# Altium project PMR_for_R124_v2.PrjPcb (part 2 of 5)

## Sheet MCU.SchDoc
size A4; DocumentNumber: 2; SheetNumber: 3; SheetTotal: 11
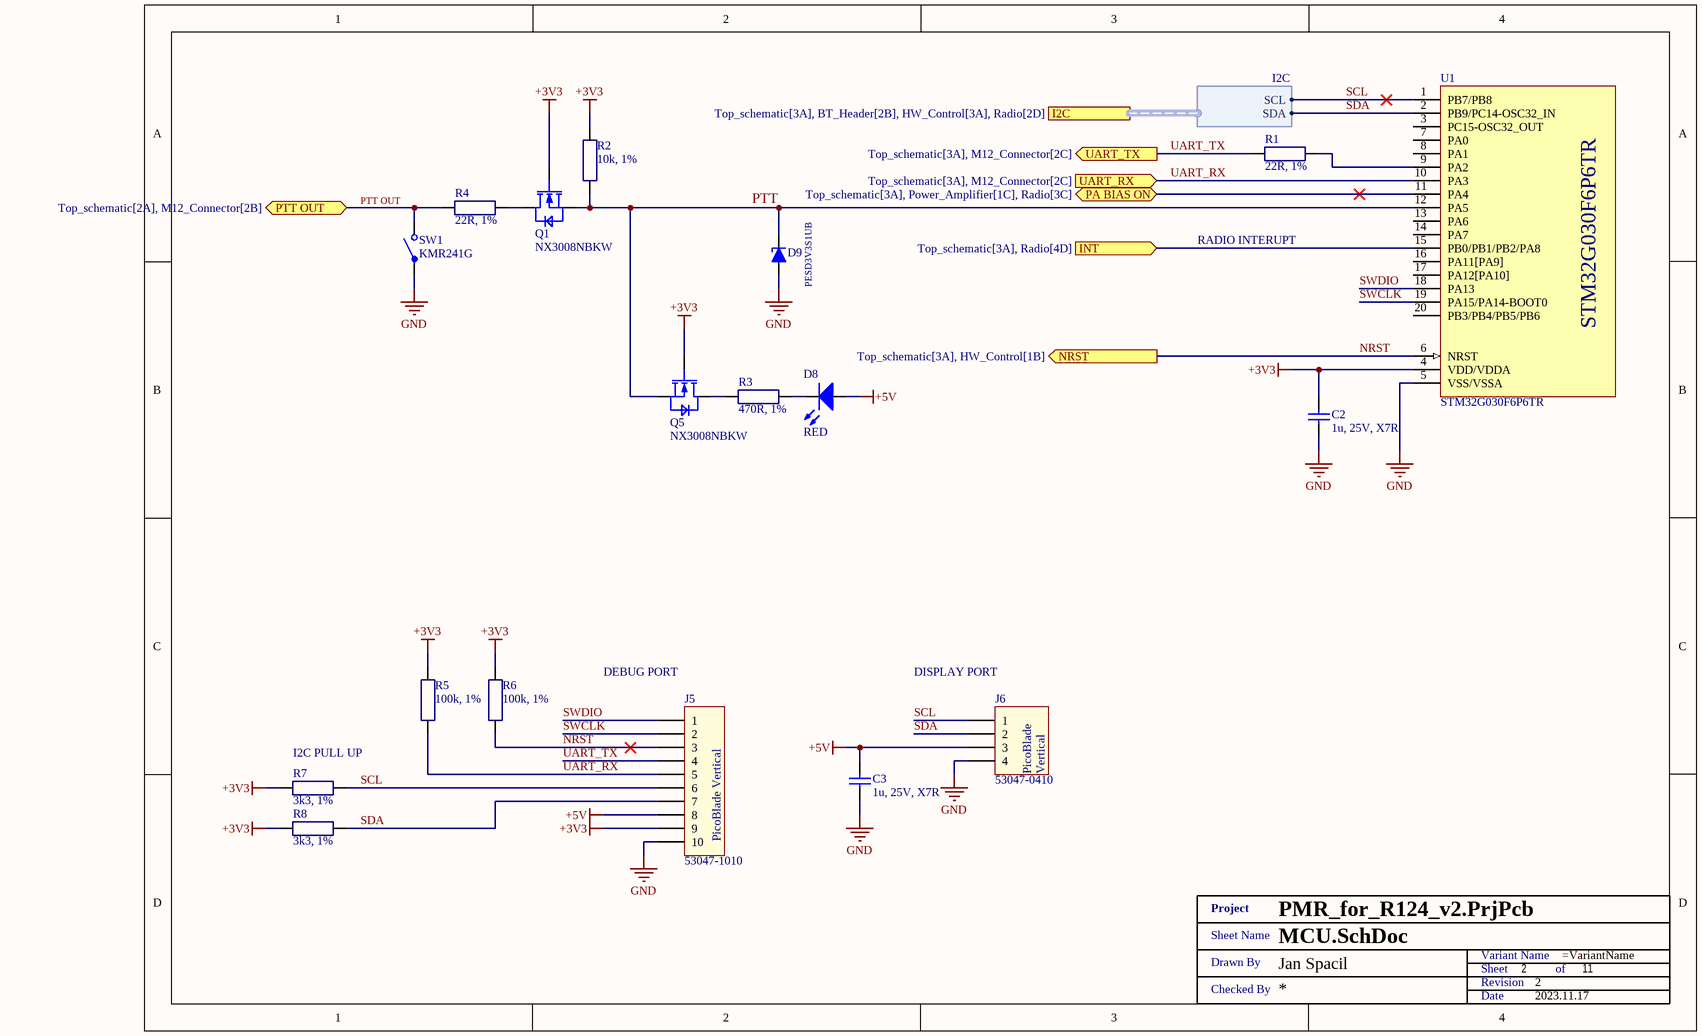
[diagram p3: MCU.SchDoc]

### Parts
(Parts that share a designator on the sheet are numbered #1, #2 ... from top to bottom, then left to right.)
C2  1u, 25V, X7R  [SMD0603]
C3  1u, 25V, X7R  [SMD0603]
D8  RED  [MCL-S270]
D9  PESD3V3S1UB  [SOD523]
J5  53047-1010  [530471010]
J6  53047-0410  [530470410]
Q1  NX3008NBKW  [SOT323]
Q5  NX3008NBKW  [SOT323]
R1  22R, 1%  [SMD0603 - R]
R2  10k, 1%  [SMD0603 - R]
R3  470R, 1%  [SMD0603 - R]
R4  22R, 1%  [SMD0603 - R]
R5  100k, 1%  [SMD0603 - R]
R6  100k, 1%  [SMD0603 - R]
R7  3k3, 1%  [SMD0603 - R]
R8  3k3, 1%  [SMD0603 - R]
SW1  KMR241G  [KMR2]
U1  STM32G030F6P6TR  [TSSOP20]
XX?#4  Title 1  (value not drawn)  (graphical)

### Ports
I2C (harness I2C, see Top_schematic[3A], BT_Header[2B], HW_Control[3A], Radio[2D]), INT (in, see Top_schematic[3A], Radio[4D]), NRST (out, see Top_schematic[3A], HW_Control[1B]), PA BIAS ON (bidir, see Top_schematic[3A], Power_Amplifier[1C], Radio[3C]), PTT OUT (bidir, see Top_schematic[2A], M12_Connector[2B]), UART_RX (in, see Top_schematic[3A], M12_Connector[2C]), UART_TX (out, see Top_schematic[3A], M12_Connector[2C])

### Harnesses
I2C: SCL, SDA

### Nets
+3V3: C2.1 J5.9 Q1.1(G) Q5.1(G) R2.1 R5.2 R6.2 R7.1 R8.1 U1.4(VDD/VDDA)
+5V: C3.1 D8.2(A) J5.8 J6.3
GND: C2.2 C3.2 D9.2(K) J5.10 J6.4 SW1.1 U1.5(VSS/VSSA)
INT: U1.15(PB0/PB1/PB2/PA8) ; port INT
NRST: J5.3 R6.1 U1.6(NRST) ; port NRST
PA BIAS ON: U1.11(PA4) ; port PA BIAS ON
PTT: D9.1(A) Q1.2(S) Q5.2(S) R2.2 U1.12(PA5)
PTT OUT: R4.1 SW1.2 ; port PTT OUT
SCL: J5.6 J6.1 R7.2 U1.1(PB7/PB8) ; port I2C.SCL
SDA: J5.7 J6.2 R8.2 U1.2(PB9/PC14-OSC32_IN) ; port I2C.SDA
SWCLK: J5.2 U1.19(PA15/PA14-BOOT0)
SWDIO: J5.1 U1.18(PA13)
UART_RX: J5.5 R5.1 U1.10(PA3) ; port UART_RX
UART_TX: J5.4 R1.1 ; port UART_TX
NetD8_1: D8.1(K) R3.1
NetQ1_3: Q1.3(D) R4.2
NetQ5_3: Q5.3(D) R3.2
NetR1_2: R1.2 U1.9(PA2)

Not connected (* = marked no-connect by the designer): U1 3(PC15-OSC32_OUT) 7(PA0) 8(PA1) 13(PA6) 14(PA7) 16(PA11[PA9]) 17(PA12[PA10]) 20(PB3/PB4/PB5/PB6)

### Notes on the sheet
- RADIO INTERUPT
- (near J5) DEBUG PORT
- (near J6) DISPLAY PORT
- (near R7) I2C PULL UP
- (in symbol 53047-0410) PicoBlade; Vertical
- (in symbol 53047-1010) PicoBlade Vertical
- (in symbol Title 1) Project; Sheet Name; Variant Name; Drawn By; Sheet; of; Revision; Checked By; Date

### Library data of the parts
C2 C3 = CGA3E1X7R1E105K080AC: CAP CER 1UF 25V X7R 0603; Manufacturer: TDK Corporation; Tolerance: ±10%; Manufacturer Part Number: CGA3E1X7R1E105K080AC; RoHS: RoHS Compliant; Category: Capacitors; Stock 1: 109509; Pricing 1: 1=0.2, 10=0.135, 100=0.0686, 500=0.04696, 1000=0.04154 (USD); Packaging: Cut Tape (CT); Part Status: Active; Voltage - Rated: 25V; Temperature Coefficient: X7R; Operating Temperature: -55°C ~ 125°C; Features: -; Ratings: AEC-Q200; Applications: Automotive; Failure Rate: -; Mounting Type: Surface Mount, MLCC; Package / Case: 0603 (1608 Metric); Size / Dimension: 0.063" L x 0.032" W (1.60mm x 0.80mm); Height - Seated (Max): -; Thickness (Max): 0.035" (0.90mm); Lead Spacing: -; Lead Style: -; ComponentLink1URL: https://product.tdk.com/info/en/catalog/datasheets/mlcc_automotive_general_en.pdf; ComponentLink1Description: https://product.tdk.com/info/en/catalog/datasheets/mlcc_automotive_general_en.pdf; Capacitance: 1u; Supplier 1: Mouser; Supplier Part Number 1: 810-CGA3E1X7R1E105K; Supplier 2: Farnell; Supplier Part Number 2: 2346962; Supplier 3: Digi-Key; Supplier Part Number 3: 445-6931-1-ND
D8 = MCL-S270SRC: MULTICOMP - MCL-S270SRC - LED, SMD, 0805, SUPER-RED; Bulb Size: 1.25mm x 1.4; Forward Current If: 20; Forward Voltage: 1.85; Wavelength Typ: 643; Luminous Intensity: 17; Viewing Angle: 140°; Lens Shape: Rectangular; SVHC: No SVHC (17-Dec-2015); Forward Voltage VF Max: 2.4; LED / Lamp Size: 1.4mm x 1.25; LED Type: Standard; Luminous Intensity Min: 14; No. of Pins: 2; Peak Forward Current: 120; Peak Wavelength: 660; Power Dissipation Pd: 100; Reverse Protection Voltage: 5; Voltage Vf Min: 1.5; Voltage Vf Typ: 1.85V<!--FANDB--><div class="features-and-benefits-container"><div class="features-and-benefits-description"><span class="features-benefits-value">The MCL-S270SRC is a super red SMD LED with water clear epoxy, made of GaAlAs dice.</span></div><div class="features-and-benefits-list"><ul class="features-and-benefits-list-list"><li class="features-and-benefits-list-item">0805 Case</li><li class="features-and-benefits-list-item">5V Reverse voltage</li><li class="features-and-benefits-list-item">10?A at 5V Reverse current</li><li class="features-and-benefits-list-item">-40 to 85; Manufacturer: MULTICOMP; Manufacturer Part Number: MCL-S270SRC; RoHS: YES; Stock 1: 27404; Pricing 1: 5=0,154, 25=0,142, 100=0,132, 250=0,0847, 500=0,0679, 2000=0,0583, 5000=0,0521, 20000=0,0455 (GBP); LED Colour: Red; LED Mounting: SMD; Packaging: Cut Tape; Product Range: -; Automotive Qualification Standard: -; MSL: MSL 3 - 168 hours; Current Rating: 20; Dominant Wavelength: 643; Dominant Wavelength Typ: 643; Forward Current If Max: 20; Luminous Intensity Max: 20; Luminous Intensity Typ: 17; Operating Temperature Max: 85; Operating Temperature Min: -40; Operating Temperature Range: -40°C to +85; Storage Temperature Max: +100; Storage Temperature Min: -40; ComponentLink1URL: http://www.farnell.com/cad/53023.pdf; ComponentLink1Description: http://www.farnell.com/cad/53023.pdf; ComponentLink2URL: http://www.farnell.com/datasheets/2182724.pdf; ComponentLink2Description: http://www.farnell.com/datasheets/2182724.pdf; Supplier 1: Farnell; Supplier Part Number 1: 1581239; Supplier 2: Newark; Supplier Part Number 2: 14N9358
D9 = PESD3V3S1UB,115: TVS DIODE 3.3V 20V SOD523; Manufacturer: Nexperia USA Inc.; Type: Zener; Voltage - Reverse Standoff (Typ): 3.3V (Max); Voltage - Breakdown (Min): 5.2V; Current - Peak Pulse (10/1000µs): 18A (8/20µs); Power - Peak Pulse: 330W; Power Line Protection: No; Capacitance @ Frequency: 207pF @ 1MHz; Manufacturer Part Number: PESD3V3S1UB,115; RoHS: RoHS Compliant; Category: Circuit Protection; Stock 1: 0; Pricing 1: 1=0.49, 10=0.368, 100=0.2082, 500=0.1379, 1000=0.10573 (USD); Packaging: Cut Tape (CT); Part Status: Active; Voltage - Clamping (Max) @ Ipp: 20V; Applications: General Purpose; Operating Temperature: -65°C ~ 150°C (TA); Mounting Type: Surface Mount; Package / Case: SC-79, SOD-523; Supplier Device Package: SOD-523; Base Part Number: PESD*S1U; ComponentLink1URL: https://assets.nexperia.com/documents/data-sheet/PESDXS1UB_SERIES.pdf; ComponentLink1Description: https://assets.nexperia.com/documents/data-sheet/PESDXS1UB_SERIES.pdf; Supplier 1: Mouser; Supplier Part Number 1: 771-PESD3V3S1UB-T/R; Supplier 2: Farnell; Supplier Part Number 2: 8737568; Supplier 3: Digi-Key; Supplier Part Number 3: 1727-3829-1-ND; Supplier 4: TME; Supplier Part Number 4: PESD3V3S1UB.115
J5 = 53047-1010: 1.25mm Pitch, PicoBlade PCB Header, Single Row, Vertical, Through Hole, Tin Plating, Friction Lock, 10 Circuits, Tray, 2.30mm PC Tail Length; Manufacturer: Molex; Number of Contacts: 10; Max Voltage Rating (DC): 125.125kV; Max Voltage Rating (AC): 125V; Current Rating: 1A; Contact Resistance: 20MR; Insulation Resistance: 100MR; Glow Wire Compliant: Non-compliant; Connector Type: Blade Pin; Supplier 1: Mouser; Supplier Part Number 1: 538-53047-1010; Manufacturer Part Number: 53047-1010; Stock 1: 9729; Pricing 1: 1 = 0.50000, 10 = 0.48800, 50 = 0.48800, 100 = 0.37400, 1000 = 0.26800, 10000 = 0.21600 (USD); RoHS: Yes; Mount: Through Hole; Contact Plating: Tin; Contact Material: Bronze; Housing Color: White; Color: Natural; Housing Material: Nylon; Body Plating: Tin; Plating: Tin; Min Operating Temperature: -40°C; Max Operating Temperature: 85°C; Termination: Solder; Number of Rows: 1; Orientation: Vertical; Packaging: Tray; Number of Positions: 10; Package Quantity: 2000; Voltage Rating: 125V; Max Current Rating: 1A; Number of Poles: 10; Voltage Rating (AC): 125V; Contact Gender: Male; Working Voltage: 125V; Current: 1A; Voltage: 125V; Number of Circuits: 10; Voltage Rating (DC): 125V; Length: 14.25mm; Height: 4.2mm; Pitch: 1.25mm; Depth: 3.2mm; Lead Pitch: 1.25mm; Radiation Hardening: No; REACH SVHC: Unknown; Lead Free: Lead Free; Flammability Rating: UL94 V-0; ComponentLink1URL: https://datasheet.ciiva.com/5151/0530471010-pcb-headers-171035-5151940.pdf?src-supplier=Mouser; ComponentLink1Description: https://datasheet.ciiva.com/5151/0530471010-pcb-headers-171035-5151940.pdf?src-supplier=Mouser; ComponentLink2URL: https://datasheet.ciiva.com/30250/7280530471010-pcb-headers-30250345.pdf?src-supplier=Onlinecomponents.com; ComponentLink2Description: https://datasheet.ciiva.com/30250/7280530471010-pcb-headers-30250345.pdf?src-supplier=Onlinecomponents.com; ComponentLink3URL: https://datasheet.ciiva.com/11747/0900766b8024e2fd-11747087.pdf?src-supplier=RSComponents; ComponentLink3Description: https://datasheet.ciiva.com/11747/0900766b8024e2fd-11747087.pdf?src-supplier=RSComponents; ComponentLink4URL: https://datasheet.ciiva.com/19461/2033252-19461670.pdf?src-supplier=Jameco; ComponentLink4Description: https://datasheet.ciiva.com/19461/2033252-19461670.pdf?src-supplier=Jameco; ComponentLink5URL: https://datasheet.ciiva.com/10083/0530471010-pcb-headers-10083962.pdf?src-supplier=Avnet; ComponentLink5Description: https://datasheet.ciiva.com/10083/0530471010-pcb-headers-10083962.pdf?src-supplier=Avnet; ComponentLink6URL: https://datasheet.ciiva.com/20207/22-3930e-20207531.pdf?src-supplier=Rapid+Electronics; ComponentLink6Description: https://datasheet.ciiva.com/20207/22-3930e-20207531.pdf?src-supplier=Rapid+Electronics; Supplier 2: Arrow; Supplier Part Number 2: 53047-1010; Stock 2: 19420; Pricing 2: 1 = 0.41890, 10 = 0.39900, 100 = 0.30530, 500 = 0.27600, 1000 = 0.24010, 8000 = 0.20770, 1 = 0.56870, 10 = 0.52970, 100 = 0.36620, 500 = 0.31550, 1000 = 0.26830, 100 = 0.37250 (USD); Supplier 3: Digi-Key; Supplier Part Number 3: WM1739-ND; Stock 3: 4931; Pricing 3: 1 = 0.52000, 10 = 0.48900, 100 = 0.37470, 500 = 0.32580, 1000 = 0.26879, 8000 = 0.21992, 16000 = 0.21666 (USD); Supplier 4: Farnell; Supplier Part Number 4: 9733086; Stock 4: 12753; Supplier 5: Mouser; Supplier Part Number 5: 538-53047-0410; Category: Headers and Wire Housings; Stock 5: 7971; Pricing 5: 1=0,27000, 10=0,23400, 100=0,18000, 500=0,15400, 1000=0,13000, 5000=0,11200, 10000=0,10400 (USD); Contact Mating Length: 0.089inch; ComponentLink7URL: https://datasheet.ciiva.com/3934/87920530470410-pcb-headers-3934064.pdf?src-supplier=Arrow; ComponentLink7Description: https://datasheet.ciiva.com/3934/87920530470410-pcb-headers-3934064.pdf?src-supplier=Arrow
J6 = 53047-0410: 1.25mm Pitch, PicoBlade PCB Header, Single Row, Vertical, Through Hole, Tin Plating, Friction Lock, 4 Circuits, Tray, 2.30mm PC Tail Length; Manufacturer: Molex; Manufacturer Part Number: 0530470410; Number of Positions: 4; Max Voltage Rating (AC): 125V; Contact Resistance: 20mR; Connector Type: Blade Pin; RoHS: Yes; Category: Headers and Wire Housings; Stock 4: 7971; Pricing 4: 1=0,27000, 10=0,23400, 100=0,18000, 500=0,15400, 1000=0,13000, 5000=0,11200, 10000=0,10400 (USD); Mount: Through Hole; Housing Material: Nylon; Contact Plating: Tin; Contact Material: Bronze; Color: Natural; Housing Color: White; Min Operating Temperature: -40°C; Max Operating Temperature: 85°C; Termination: Solder; Number of Contacts: 4; Packaging: Tray; Number of Rows: 1; Orientation: Straight; Length: 6.75mm; Pitch: 1.25mm; Contact Mating Length: 0.089inch; Depth: 3.2mm; ComponentLink1URL: https://datasheet.ciiva.com/3934/87920530470410-pcb-headers-3934064.pdf?src-supplier=Arrow; ComponentLink1Description: https://datasheet.ciiva.com/3934/87920530470410-pcb-headers-3934064.pdf?src-supplier=Arrow; Supplier 1: Mouser; Supplier Part Number 1: 538-53047-0410; Supplier 2: Farnell; Supplier Part Number 2: 9733060; Supplier 3: Digi-Key; Supplier Part Number 3: WM1733-ND; Supplier 4: Avnet; Supplier Part Number 4: 0530470410
Q1 Q5 = NX3008NBKW: NXP - NX3008NBKW - MOSFET, N CH, 30V, 350MA, SOT323; Transistor Polarity: N Channel; Continuous Drain Current Id: 350; Drain Source Voltage Vds: 30; On Resistance Rds(on): 1; Rds(on) Test Voltage Vgs: 4.5; Threshold Voltage Vgs: 900; Power Dissipation Pd: 260; Transistor Case Style: SOT-323; No. of Pins: 3; SVHC: No SVHC (17-Dec-2015); Pulse Current Idm: -0.8; Voltage Vgs th Max: 8; Manufacturer: NXP; Manufacturer Part Number: NX3008NBKW; RoHS: YES; Stock 1: 4764; Pricing 1: 1=0.0425, 25=0.0385, 100=0.0347, 250=0.0334, 500=0.0312, 2000=0.0291, 4000=0.0282, 20000=0.0273 (GBP); Operating Temperature Max: 150; Product Range: -; Automotive Qualification Standard: -; MSL: MSL 1 - Unlimited; Operating Temperature Min: -55; Operating Temperature Range: -55°C to +150; ComponentLink1URL: http://www.farnell.com/datasheets/1508392.pdf; ComponentLink1Description: http://www.farnell.com/datasheets/1508392.pdf; Supplier 1: Mouser; Supplier Part Number 1: 771-NX3008NBKW,115; Supplier 2: Farnell; Supplier Part Number 2: 2069546; Supplier 3: Arrow; Supplier Part Number 3: NX3008NBKW,115
R1 R4 = RC0603FR-0722RL: YAGEO (PHYCOMP) - RC0603FR-0722RL - RES, THICK FILM, 22R, 1%, 0.1W, 0603; Voltage Rating: 50; Resistor Case Style: 0603 [1608 Metric]; Power Rating: 100; Product Range: RC Series; Temperature Coefficient: ± 100; SVHC: No SVHC (20-Jun-2016); External Depth: 0.45; External Length / Height: 1.6; External Width: 0.8; Full Power Rating Temperature: 70; No. of Pins: 2; Reel Quantity: 5000; Resistor Mounting: Surface Mount Device; Voltage Rating V DC: 50V<!--FANDB--><div class="features-and-benefits-container"><div class="features-and-benefits-desc-container"><span class="features-and-benefits-container-desc">SMD Chip Resistor, Thick Film, 22 ohm, 50 V, 0603 [1608 Metric], 100 mW, ± 1%, RC Series</span></div><div class="features-and-benefits-description"><span class="features-benefits-value">The Yageo RC_L series resistors are general purpose thick film chip resistors with lead free terminations made by thick film process. The resistance range includes E24 and E96 decade values from 1ohm to 100Mohm. These resistors are constructed on top of a high grade ceramic body.</span></div><div class="features-and-benefits-list"><ul class="features-and-benefits-list-list"><li class="features-and-benefits-list-item">EIA 0075, 0100, 0201, 0402, 0603, 0805, 1206, 1210, 1218, 2010, 2512 case sizes available</li><li class="features-and-benefits-list-item">Small chip sizes save PCB space</li><li class="features-and-benefits-list-item">Rated voltage range of 10V to 200V</li><li class="features-and-benefits-list-item">Maximum power rating of 2W</li><li class="features-and-benefits-list-item">Available in ±0.1%, ±0.5%, ±1% and ±5% tolerance</li><li class="features-and-benefits-list-item">High component and equipment reliability</li><li class="features-and-benefits-list-item">Forbidden materials are not used in products/production</li><li class="features-and-benefits-list-item">-55°C to 155°C temperature range for RC0402 to RC2512 and -55°C to 125°C for RC0075 to RC0201; Manufacturer: YAGEO (PHYCOMP); Manufacturer Part Number: RC0603FR-0722RL; RoHS: YES; Stock 1: 33025; Pricing 1: 10=0.0102, 100=0.0068, 500=0.0051, 1000=0.0041, 2500=0.0034 (GBP); Resistance: 22R; Resistance Tolerance: ± 1%; Packaging: Cut Tape; Resistor Element Material: Thick Film; Automotive Qualification Standard: -; MSL: MSL 1 - Unlimited; Operating Temperature Max: 155; Operating Temperature Min: -55; Operating Temperature Range: -55°C to +155; Temperature Coeff. +: 100; Temperature Coeff. -: 100; Tolerance +: 1%; Tolerance -: 1%; ComponentLink1URL: http://www.farnell.com/datasheets/2167052.pdf; ComponentLink1Description: http://www.farnell.com/datasheets/2167052.pdf; ComponentLink2URL: http://www.farnell.com/cad/1555248.zip; ComponentLink2Description: http://www.farnell.com/cad/1555248.zip; Supplier 1: Mouser; Supplier Part Number 1: 603-RC0603FR-0722RL; Supplier 2: Farnell; Supplier Part Number 2: 9238280; Supplier 3: Digi-Key; Supplier Part Number 3: 311-22.0HRCT-ND
R2 = RC0603FR-0710KL: YAGEO (PHYCOMP) - RC0603FR-0710KL - RES, THICK FILM, 10K, 1%, 0.1W, 0603; Voltage Rating: 50; Resistor Case Style: 0603 [1608 Metric]; Power Rating: 100; Product Range: RC Series; Temperature Coefficient: ± 100; SVHC: No SVHC (20-Jun-2016); Manufacturer: YAGEO (PHYCOMP); Manufacturer Part Number: RC0603FR-0710KL; RoHS: YES; Stock 1: 9995; Pricing 1: 5000=0.0025, 25000=0.0014, 50000=0.0013 (GBP); Resistance: 10k; Resistance Tolerance: ± 1%; Packaging: Tape & Reel; Resistor Element Material: Thick Film; Automotive Qualification Standard: -; MSL: MSL 1 - Unlimited<!--FANDB--><div class="features-and-benefits-container"><div class="features-and-benefits-desc-container"><span class="features-and-benefits-container-desc">SMD Chip Resistor, Thick Film, 10 kohm, 50 V, 0603 [1608 Metric], 100 mW, ± 1; ComponentLink1URL: http://past.yageo.com/pdf/PYu-R_Packing_6.pdf; ComponentLink1Description: http://past.yageo.com/pdf/PYu-R_Packing_6.pdf; ComponentLink2URL: http://www.farnell.com/datasheets/2167052.pdf; ComponentLink2Description: http://www.farnell.com/datasheets/2167052.pdf; Supplier 1: Mouser; Supplier Part Number 1: 603-RC0603FR-0710KL; Supplier 2: Farnell; Supplier Part Number 2: 2421850; Supplier 3: Digi-Key; Supplier Part Number 3: 311-10.0KHRCT-ND
R3 = RC0603FR-07470RL: YAGEO         RC0603FR-07470RL             SMD Chip Resistor, Thick Film, 470 ohm, 50 V, 0603 [1608 Metric], 100 mW,  1%, RC Series; Power Rating: 100mW; Voltage Rating: 50V; Temperature Coefficient: 100ppm/°C; Working Voltage: 75V; Supplier 1: Mouser; Supplier Part Number 1: 603-RC0603FR-07470RL; Manufacturer: Yageo; Manufacturer Part Number: RC0603FR-07470RL; RoHS: Yes; Category: Chip SMD Resistors; Stock 1: 361309; Pricing 1: 1=0,10000, 10=0,01800, 100=0,00600, 1000=0,00500, 5000=0,00300, 10000=0,00300 (USD); Case/Package: 0603; Case Code (Metric): 1608; Case Code (Imperial): 0603; Min Operating Temperature: -55°C; Max Operating Temperature: 155°C; Tolerance: 1%; Resistance: 470R; Packaging: Tape and Reel; Package Quantity: 1; Composition: Thick Film; Number of Terminations: 2; Termination: SMD/SMT; Military Standard: Not; Max Power Dissipation: 100mW; Features: Moisture Resistant; Length: 1.6mm; Height: 0.022inch; Width: 0.031inch; Depth: 0.8mm; REACH SVHC: No SVHC; Lead Free: Lead Free; ComponentLink1URL: https://datasheet.ciiva.com/11808/0900766b80f96399-11808177.pdf?src-supplier=RSComponents; ComponentLink1Description: https://datasheet.ciiva.com/11808/0900766b80f96399-11808177.pdf?src-supplier=RSComponents; ComponentLink2URL: https://datasheet.ciiva.com/7746/1738695-7746359.pdf?src-supplier=Element14; ComponentLink2Description: https://datasheet.ciiva.com/7746/1738695-7746359.pdf?src-supplier=Element14; ComponentLink3URL: https://datasheet.ciiva.com/7746/1738695-7746360.pdf?src-supplier=Element14; ComponentLink3Description: https://datasheet.ciiva.com/7746/1738695-7746360.pdf?src-supplier=Element14; ComponentLink4URL: https://datasheet.ciiva.com/7660/1868787-7660793.pdf?src-supplier=Element14; ComponentLink4Description: https://datasheet.ciiva.com/7660/1868787-7660793.pdf?src-supplier=Element14; ComponentLink5URL: https://datasheet.ciiva.com/46440/1868787-46440907.pdf?src-supplier=Element14; ComponentLink5Description: https://datasheet.ciiva.com/46440/1868787-46440907.pdf?src-supplier=Element14; ComponentLink6URL: https://datasheet.ciiva.com/2454/pyu-r-int-thick-7-2454012.pdf?src-supplier=Digi-Key; ComponentLink6Description: https://datasheet.ciiva.com/2454/pyu-r-int-thick-7-2454012.pdf?src-supplier=Digi-Key; ComponentLink7URL: https://datasheet.ciiva.com/2454/pyu-r-int-thick-7-2454013.pdf?src-supplier=Digi-Key; ComponentLink7Description: https://datasheet.ciiva.com/2454/pyu-r-int-thick-7-2454013.pdf?src-supplier=Digi-Key; ComponentLink8URL: https://datasheet.ciiva.com/2454/pyu-r-int-thick-7-2454014.pdf?src-supplier=Digi-Key; ComponentLink8Description: https://datasheet.ciiva.com/2454/pyu-r-int-thick-7-2454014.pdf?src-supplier=Digi-Key; Supplier 2: Farnell; Supplier Part Number 2: 2421875; Supplier 3: Digi-Key; Supplier Part Number 3: 311-470HRDKR-ND
R5 R6 = RC0603FR-07100KL: RES SMD 100K OHM 1% 1/10W 0603; Manufacturer: Yageo; Power (Watts): 0.1W, 1/10W; Temperature Coefficient: ±100ppm/°C; Manufacturer Part Number: RC0603FR-07100KL; RoHS: RoHS Compliant; Category: Resistors; Stock 1: 14618646; Pricing 1: 1=0.1, 10=0.015, 100=0.006, 1000=0.00268, 2500=0.00233 (USD); Packaging: Cut Tape (CT); Part Status: Active; Tolerance: ±1%; Composition: Thick Film; Features: Moisture Resistant; Operating Temperature: -55°C ~ 155°C; Package / Case: 0603 (1608 Metric); Supplier Device Package: 0603; Size / Dimension: 0.063" L x 0.032" W (1.60mm x 0.80mm); Height - Seated (Max): 0.022" (0.55mm); Failure Rate: -; ComponentLink1URL: http://www.yageo.com/documents/recent/PYu-RC_Group_51_RoHS_L_8.pdf; ComponentLink1Description: http://www.yageo.com/documents/recent/PYu-RC_Group_51_RoHS_L_8.pdf; Resistance: 100k; Supplier 1: Mouser; Supplier Part Number 1: 603-RC0603FR-07100KL; Supplier 2: Farnell; Supplier Part Number 2: 9238727; Supplier 3: Digi-Key; Supplier Part Number 3: 311-100KHRCT-ND
R7 R8 = RC0603FR-073K3L: YAGEO - RC0603FR-073K3L - SMD Chip Resistor, 0603 [1608 Metric], 3.3 kohm, RC Series, 75 V, Thick Film, 100 mW; Voltage Rating (DC): 50V; Temperature Coefficient: 100ppm/°C; Power Rating: 100mW; Supplier 1: Mouser; Supplier Part Number 1: 603-RC0603FR-073K3L; Manufacturer: Yageo; Manufacturer Part Number: RC0603FR-073K3L; RoHS: Yes; Category: Chip SMD Resistors; Stock 1: 695285; Pricing 1: 1=0,10000, 10=0,01800, 100=0,00600, 1000=0,00500, 5000=0,00300, 10000=0,00300 (USD); Case/Package: 0603; Number of Pins: 2; Case Code (Imperial): 0603; Case Code (Metric): 1608; Min Operating Temperature: -55°C; Max Operating Temperature: 155°C; Resistance: 3k3; Tolerance: 1%; Packaging: Tape and Reel; Composition: Thick Film; Voltage Rating: 50V; Package Quantity: 1; Termination: SMD/SMT; Number of Terminations: 2; Military Standard: Not; Max Power Dissipation: 100mW; Features: Moisture Resistant; Length: 1.6mm; Height: 0.45mm; Width: 0.8mm; Depth: 0.8mm; REACH SVHC: No SVHC; Lead Free: Lead Free; ComponentLink1URL: https://datasheet.ciiva.com/2453/pyu-r-int-thick-7-2453926.pdf?src-supplier=Digi-Key; ComponentLink1Description: https://datasheet.ciiva.com/2453/pyu-r-int-thick-7-2453926.pdf?src-supplier=Digi-Key; ComponentLink2URL: https://datasheet.ciiva.com/2453/pyu-r-int-thick-7-2453927.pdf?src-supplier=Digi-Key; ComponentLink2Description: https://datasheet.ciiva.com/2453/pyu-r-int-thick-7-2453927.pdf?src-supplier=Digi-Key; ComponentLink3URL: https://datasheet.ciiva.com/7746/443971-7746344.pdf?src-supplier=Element14; ComponentLink3Description: https://datasheet.ciiva.com/7746/443971-7746344.pdf?src-supplier=Element14; ComponentLink4URL: https://datasheet.ciiva.com/7746/1686128-7746345.pdf?src-supplier=Element14; ComponentLink4Description: https://datasheet.ciiva.com/7746/1686128-7746345.pdf?src-supplier=Element14; ComponentLink5URL: https://datasheet.ciiva.com/46440/1868787-46440905.pdf?src-supplier=Element14; ComponentLink5Description: https://datasheet.ciiva.com/46440/1868787-46440905.pdf?src-supplier=Element14; ComponentLink6URL: https://datasheet.ciiva.com/7746/443971-7746346.pdf?src-supplier=Element14; ComponentLink6Description: https://datasheet.ciiva.com/7746/443971-7746346.pdf?src-supplier=Element14; Supplier 2: Farnell; Supplier Part Number 2: 2421870; Supplier 3: Digi-Key; Supplier Part Number 3: 311-3.30KHRCT-ND
SW1 = KMR241G LFS: C & K COMPONENTS - KMR241G LFS - SWITCH, SMD, 4N, 0.05A, 32VDC, SPST-NO; Illumination: Non Illuminated; Contact Voltage DC Nom: 32; Contact Current Max: 50; Operating Force: 4; Switch Terminals: Solder; SVHC: No SVHC (17-Dec-2015); Actuation Type: Top; Actuator / Cap Colour: Black; Contact Resistance: 100; External Depth: 2.8; External Length / Height: 1.9; External Width: 4.6; Power Rating: 1VA<!--FANDB--><div class="features-and-benefits-container"><div class="features-and-benefits-description"><span class="features-benefits-value">The KMR241G LFS is a micro-miniature SMD Tactile Switch with momentary action and SPST-NO contact arrangement. It has silver-plated gull-wing terminals and grounding pin.</span></div><div class="features-and-benefits-list"><ul class="features-and-benefits-list-list"><li class="features-and-benefits-list-item">Top actuated</li><li class="features-and-benefits-list-item">Excellent tactile feel</li><li class="features-and-benefits-list-item">Ultra low current capabilities</li><li class="features-and-benefits-list-item">300000-cycle Operating life</li><li class="features-and-benefits-list-item">IP40 Protection rating</li></ul></div><div class="features-and-benefits-applications"><ul class="features-and-benefits-value"><li class="features-and-benefits-list-item">Automotive</li><li class="features-and-benefits-list-item">Industrial</li><li class="features-and-benefits-list-item">Medical</li><li class="features-and-benefits-list-item">Portable Devices</li></ul></div></div>; Manufacturer: C & K COMPONENTS; Manufacturer Part Number: KMR241G LFS; RoHS: YES; Stock 1: 40256; Pricing 1: 1=0.384, 50=0.37, 100=0.218, 7000=0.185, 20000=0.181, 30000=0.178, 50000=0.174 (GBP); Product Range: -; Contact Configuration: SPST-NO; Operating Temperature Max: 85; Operating Temperature Min: -40; ComponentLink1URL: http://www.farnell.com/datasheets/1702857.pdf; ComponentLink1Description: http://www.farnell.com/datasheets/1702857.pdf; Supplier 1: Mouser; Supplier Part Number 1: 611-KMR241GLFS; Supplier 2: Farnell; Supplier Part Number 2: 1437637; Supplier 3: Digi-Key; Supplier Part Number 3: CKN10248DKR-ND
U1 = STM32G030F6P6TR: MCU 32-Bit STM32 ARM Cortex-M0+ RISC 32KB Flash 2V to 3.6V 20-Pin TSSOP T/R; Manufacturer: STMicroelectronics; Supplier 1: Mouser; Supplier Part Number 1: 511-STM32G030F6P6TR; Manufacturer Part Number: STM32G030F6P6TR; RoHS: Yes; Category: Microcontrollers; Stock 1: 3310; Pricing 1: 1=1.84000, 10=1.66000, 50=1.66000, 100=1.29000, 250=1.21000, 500=1.07000, 1000=0.84100, 2500=0.78400, 5000=0.74700, 10000=0.74700 (USD); Supplier 2: Digi-Key; Supplier Part Number 2: 497-STM32G030F6P6TRCT-ND

## Sheet M12_Connector.SchDoc
size A4; DocumentNumber: 1; SheetNumber: 2; SheetTotal: 11
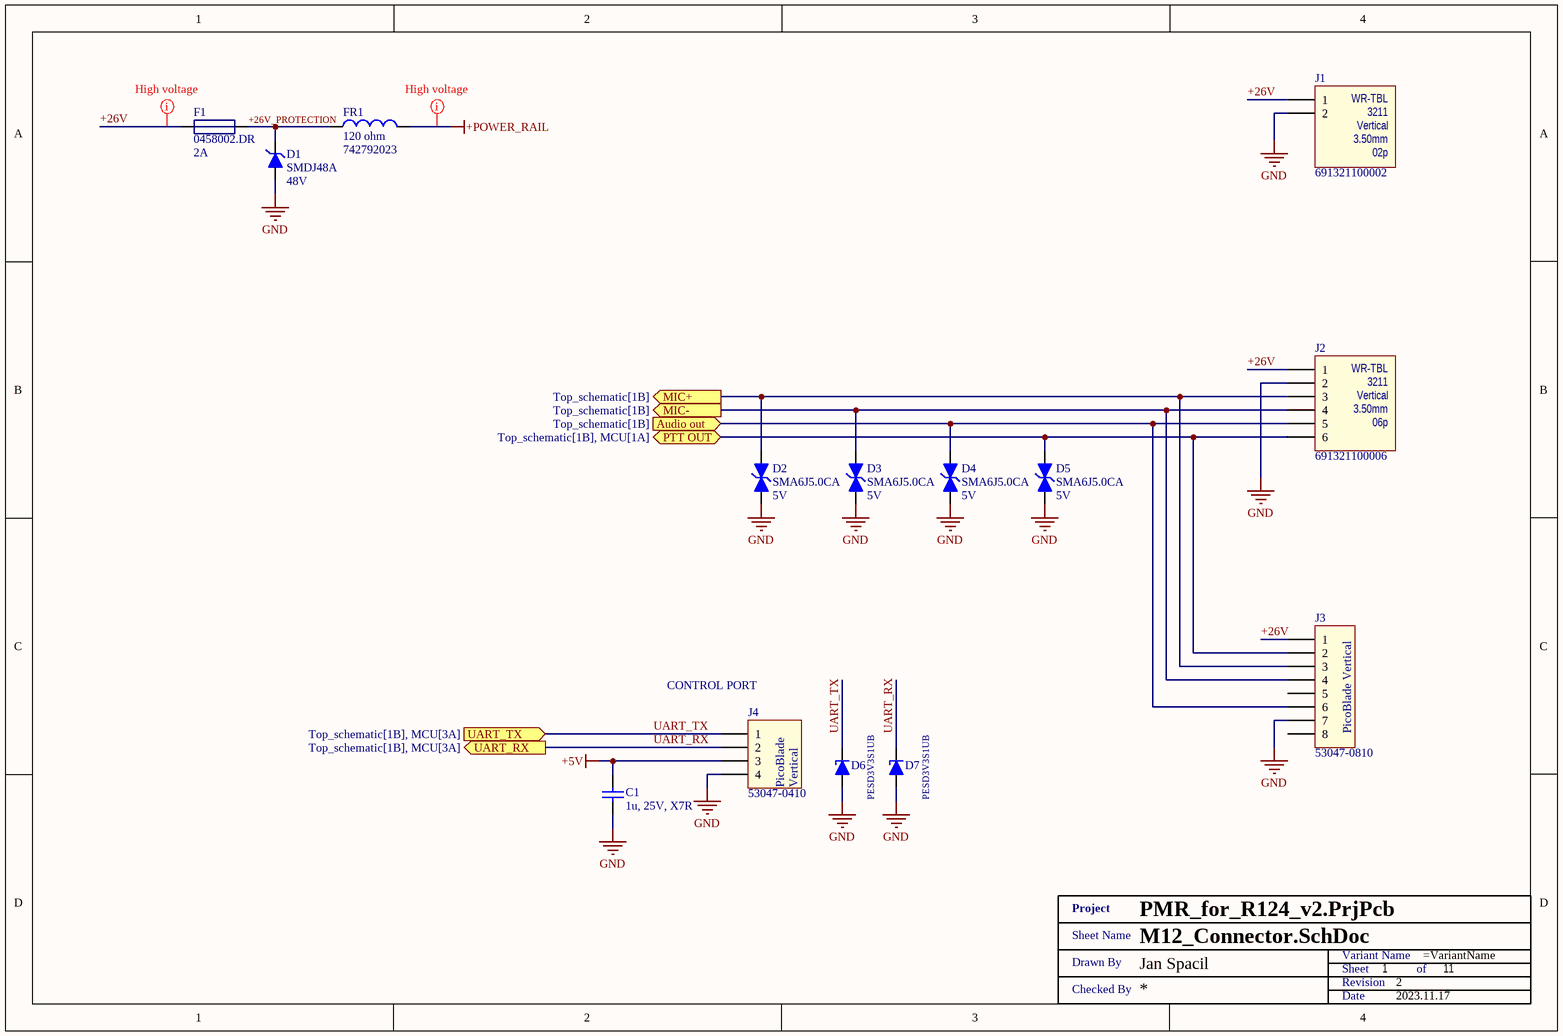
[diagram p4: M12_Connector.SchDoc]

### Parts
(Parts that share a designator on the sheet are numbered #1, #2 ... from top to bottom, then left to right.)
C1  1u, 25V, X7R  [SMD0603]
D1  SMDJ48A  Reverse Standoff Voltage: 48V  [DO-214AB]
D2  SMA6J5.0CA  Reverse Standoff Voltage: 5V  [DO-214AC]
D3  SMA6J5.0CA  Reverse Standoff Voltage: 5V  [DO-214AC]
D4  SMA6J5.0CA  Reverse Standoff Voltage: 5V  [DO-214AC]
D5  SMA6J5.0CA  Reverse Standoff Voltage: 5V  [DO-214AC]
D6  PESD3V3S1UB  [SOD523]
D7  PESD3V3S1UB  [SOD523]
F1  0458002.DR  Current Rating: 2A  [SMD1206 - FUSE]
FR1  120 ohm  [SMD0805 - R]
J1  691321100002  [691321100002]
J2  691321100006  [691321100006]
J3  53047-0810  [530470810]
J4  53047-0410  [530470410]
XX?#5  Title 1  (value not drawn)  (graphical)

### Ports
Audio out (in, see Top_schematic[1B]), MIC+ (out, see Top_schematic[1B]), MIC- (out, see Top_schematic[1B]), PTT OUT (bidir, see Top_schematic[1B], MCU[1A]), UART_RX (out, see Top_schematic[1B], MCU[3A]), UART_TX (in, see Top_schematic[1B], MCU[3A])

### Nets
+5V: C1.1 J4.3
+POWER_RAIL: FR1.2
GND: C1.2 D1.2 D2.1(A) D3.1(A) D4.1(A) D5.1(A) D6.2(K) D7.2(K) J1.2 J2.2 J3.7 J4.4
+26V: F1.1 J1.1 J2.1 J3.1
+26V_PROTECTION: D1.1 F1.2 FR1.1
PTT OUT: D5.2(K) J2.6 J3.2 ; port PTT OUT
UART_RX: D7.1(A) J4.2 ; port UART_RX
UART_TX: D6.1(A) J4.1 ; port UART_TX
NetC29_1: D3.2(K) J2.4 J3.4 ; port MIC-
NetC29_2: D2.2(K) J2.3 J3.3 ; port MIC+
NetC42_2: D4.2(K) J2.5 J3.6 ; port Audio out

Not connected (* = marked no-connect by the designer): J3 5 8

### Layout directives
net class HV: +26V, +POWER_RAIL

### Notes on the sheet
- (near J4) CONTROL PORT
- (in symbol 53047-0410) PicoBlade; Vertical
- (in symbol 53047-0810) PicoBlade Vertical
- (in symbol 691321100002) WR-TBL; 3211; 3.50mm; 02p
- (in symbol 691321100006) WR-TBL; 3211; 3.50mm; 06p
- (in symbol Title 1) Project; Sheet Name; Variant Name; Drawn By; Sheet; of; Revision; Checked By; Date

### Library data of the parts
C1 = CGA3E1X7R1E105K080AC: as C2 on sheet MCU; Manufacturer Part Number: CGA3E1X7R1E105K080AC; RoHS: RoHS Compliant; Category: Capacitors; Stock 1: 109509; Pricing 1: 1=0.2, 10=0.135, 100=0.0686, 500=0.04696, 1000=0.04154 (USD); Packaging: Cut Tape (CT); Part Status: Active; Voltage - Rated: 25V; Temperature Coefficient: X7R; Operating Temperature: -55°C ~ 125°C; Features: -; Ratings: AEC-Q200; Applications: Automotive; Failure Rate: -; Mounting Type: Surface Mount, MLCC; Package / Case: 0603 (1608 Metric); Size / Dimension: 0.063" L x 0.032" W (1.60mm x 0.80mm); Height - Seated (Max): -; Thickness (Max): 0.035" (0.90mm); Lead Spacing: -; Lead Style: -; ComponentLink1URL: https://product.tdk.com/info/en/catalog/datasheets/mlcc_automotive_general_en.pdf; ComponentLink1Description: https://product.tdk.com/info/en/catalog/datasheets/mlcc_automotive_general_en.pdf; Capacitance: 1u; Supplier 1: Mouser; Supplier Part Number 1: 810-CGA3E1X7R1E105K; Supplier 2: Farnell; Supplier Part Number 2: 2346962; Supplier 3: Digi-Key; Supplier Part Number 3: 445-6931-1-ND
D1 = SMDJ48A: J Series 53.3 V 3000 W Surface Mount Uni-Directional TVS Diode - DO-214AB; Manufacturer: Littelfuse; Supplier 1: Mouser; Supplier Part Number 1: 576-SMDJ48A; Manufacturer Part Number: SMDJ48A; RoHS: Yes; Category: TVS Diodes; Stock 1: 11613; Pricing 1: 1=1.02, 10=0.889, 50=0.889, 100=0.688, 1000=0.471, 10000=0.408 (USD); ComponentLink1URL: https://datasheet.ciiva.com/16487/littelfuse-tvs-diodes-smdj-16487926.pdf?src-supplier=Future+Electronics; ComponentLink1Description: https://datasheet.ciiva.com/16487/littelfuse-tvs-diodes-smdj-16487926.pdf?src-supplier=Future+Electronics; ComponentLink2URL: https://datasheet.ciiva.com/332/littelfuse-tvs-diode-smdj-datasheet-pdf-332813.pdf?src-supplier=Digi-Key; ComponentLink2Description: https://datasheet.ciiva.com/332/littelfuse-tvs-diode-smdj-datasheet-pdf-332813.pdf?src-supplier=Digi-Key; ComponentLink3URL: https://datasheet.ciiva.com/332/littelfuse-tvs-diode-smdj-datasheet-pdf-332814.pdf?src-supplier=Digi-Key; ComponentLink3Description: https://datasheet.ciiva.com/332/littelfuse-tvs-diode-smdj-datasheet-pdf-332814.pdf?src-supplier=Digi-Key; ComponentLink4URL: https://datasheet.ciiva.com/332/littelfuse-tvs-diode-smdj-datasheet-pdf-332815.pdf?src-supplier=Digi-Key; ComponentLink4Description: https://datasheet.ciiva.com/332/littelfuse-tvs-diode-smdj-datasheet-pdf-332815.pdf?src-supplier=Digi-Key; Supplier 2: Farnell; Supplier Part Number 2: 2762843; Supplier 3: Digi-Key; Supplier Part Number 3: SMDJ48ACT-ND
D2-D5 = SMA6J5.0CA: ESD Suppressors / TVS Diodes 600W 5V 5% Bi-Directional; Manufacturer: Littelfuse; Supplier 1: Mouser; Supplier Part Number 1: 576-SMA6J5.0CA; Manufacturer Part Number: SMA6J5.0CA; RoHS: Yes; Category: TVS Diodes; Stock 1: 57321; Pricing 1: 1=0.41, 10=0.35, 50=0.35, 100=0.243, 1000=0.139, 10000=0.115 (USD); ComponentLink1URL: http://www.farnell.com/datasheets/2736094.pdf?src-supplier=Farnell; ComponentLink1Description: http://www.farnell.com/datasheets/2736094.pdf?src-supplier=Farnell; ComponentLink2URL: https://datasheet.octopart.com/SMA6J5.0CA-Littelfuse-datasheet-114785799.pdf?src-supplier=Future+Electronics; ComponentLink2Description: https://datasheet.octopart.com/SMA6J5.0CA-Littelfuse-datasheet-114785799.pdf?src-supplier=Future+Electronics; ComponentLink3URL: https://www.littelfuse.com/~/media/electronics/datasheets/tvs_diodes/littelfuse_tvs_diode_sma6j_datasheet.pdf.pdf?src-supplier=Digi-Key; ComponentLink3Description: https://www.littelfuse.com/~/media/electronics/datasheets/tvs_diodes/littelfuse_tvs_diode_sma6j_datasheet.pdf.pdf?src-supplier=Digi-Key; ComponentLink4URL: http://www.farnell.com/datasheets/2736094.pdf?src-supplier=Newark; ComponentLink4Description: http://www.farnell.com/datasheets/2736094.pdf?src-supplier=Newark; ComponentLink5URL: http://www.farnell.com/datasheets/2736094.pdf?src-supplier=Element14; ComponentLink5Description: http://www.farnell.com/datasheets/2736094.pdf?src-supplier=Element14; Supplier 2: Farnell; Supplier Part Number 2: 3010381; Supplier 3: Digi-Key; Supplier Part Number 3: 18-SMA6J5.0CACT-ND
D6 D7 = PESD3V3S1UB,115: as D9 on sheet MCU; Manufacturer Part Number: PESD3V3S1UB,115; RoHS: RoHS Compliant; Category: Circuit Protection; Stock 1: 0; Pricing 1: 1=0.49, 10=0.368, 100=0.2082, 500=0.1379, 1000=0.10573 (USD); Packaging: Cut Tape (CT); Part Status: Active; Voltage - Clamping (Max) @ Ipp: 20V; Applications: General Purpose; Operating Temperature: -65°C ~ 150°C (TA); Mounting Type: Surface Mount; Package / Case: SC-79, SOD-523; Supplier Device Package: SOD-523; Base Part Number: PESD*S1U; ComponentLink1URL: https://assets.nexperia.com/documents/data-sheet/PESDXS1UB_SERIES.pdf; ComponentLink1Description: https://assets.nexperia.com/documents/data-sheet/PESDXS1UB_SERIES.pdf; Supplier 1: Mouser; Supplier Part Number 1: 771-PESD3V3S1UB-T/R; Supplier 2: Farnell; Supplier Part Number 2: 8737568; Supplier 3: Digi-Key; Supplier Part Number 3: 1727-3829-1-ND; Supplier 4: TME; Supplier Part Number 4: PESD3V3S1UB.115
F1 = 0458002.DR: FUSE BRD MNT 2A 48VAC 75VDC 1206; Manufacturer: Littelfuse; Body Material: Ceramic; Voltage Rating (AC): 48V; Voltage Rating (DC): 75V; Resistance: 69.5mR; DC Cold Resistance: 63.5mR; Fuse Type: Board Mount (Cartridge Style Excluded); Voltage Rating: 63V; Approvals: cULus; Supplier 1: Mouser; Supplier Part Number 1: 576-0458002.DR; Manufacturer Part Number: 0458002.DR; Stock 1: 11466; Pricing 1: 1 = 1.31000, 10 = 0.97500, 50 = 0.97500, 100 = 0.81200, 1000 = 0.67000, 10000 = 0.50800 (USD); RoHS: Yes; Mount: Surface Mount; Case/Package: 1206; Case Code (Metric): 3216; Case Code (Imperial): 1206; Housing Material: Ceramic; Min Operating Temperature: -55°C; Max Operating Temperature: 125°C; Packaging: Tape and Reel; Package Quantity: 1500; Fuse Current: 2A; Termination: SMD/SMT; Working Voltage: 63V; Length: 0.125inch; Height: 0.062inch; Width: 1.575mm; Depth: 1.58mm; REACH SVHC: No SVHC; Lead Free: Lead Free; ComponentLink1URL: https://datasheet.ciiva.com/1730/337915-1730544.pdf?src-supplier=Newark; ComponentLink1Description: https://datasheet.ciiva.com/1730/337915-1730544.pdf?src-supplier=Newark; ComponentLink2URL: https://datasheet.ciiva.com/299/littelfuse-fuse-458-series-299804.pdf?src-supplier=Digi-Key; ComponentLink2Description: https://datasheet.ciiva.com/299/littelfuse-fuse-458-series-299804.pdf?src-supplier=Digi-Key; ComponentLink3URL: https://datasheet.ciiva.com/299/littelfuse-fuse-458-series-299805.pdf?src-supplier=Digi-Key; ComponentLink3Description: https://datasheet.ciiva.com/299/littelfuse-fuse-458-series-299805.pdf?src-supplier=Digi-Key; ComponentLink4URL: https://datasheet.ciiva.com/299/littelfuse-fuse-458-series-299806.pdf?src-supplier=Digi-Key; ComponentLink4Description: https://datasheet.ciiva.com/299/littelfuse-fuse-458-series-299806.pdf?src-supplier=Digi-Key; Supplier 2: Farnell; Supplier Part Number 2: 1702533; Stock 2: 1620; Supplier 3: Digi-Key; Supplier Part Number 3: F2931CT-ND; Stock 3: 14221; Pricing 3: 1 = 1.43000, 5 = 1.38400, 10 = 1.29500, 50 = 1.07180, 100 = 0.89320, 250 = 0.87088, 500 = 0.73690 (USD)
FR1 = 742792023: WURTH ELEKTRONIK - 742792023 - FERRITE BEAD, 0.03OHM, 3A, 0805; Impedance @ 100MHz: 120; Ferrite Case Style: 0805 [2012 Metric]; DC Current Rating: 3; DC Resistance Max: 0.03; Impedance Tolerance: ± 25%; Ferrite Mounting: SMD; Resistance: 0.03ohm<!--FANDB--><div class="features-and-benefits-container"><div class="features-and-benefits-description"><span class="features-benefits-value">The 742792023 is a SMD EMI Suppression Ferrite Bead with 0805 case and reliable Ni-Sn electrodes. It can be put directly on the printed circuit board. It offers excellent anti-EMI properties and low DC resistance. Placed very close next to the interference source even with smallest size 0402, maximal impedance at 1000; Manufacturer: WURTH ELEKTRONIK; RoHS: YES; Stock 1: 4283; Pricing 1: 1=0,123, 50=0,112, 100=0,103, 500=0,0937, 1000=0,0877, 2000=0,0846 (GBP); Product Range: -; Automotive Qualification Standard: -; Packaging: Cut Tape; ComponentLink1URL: http://www.farnell.com/datasheets/1695980.pdf; ComponentLink1Description: http://www.farnell.com/datasheets/1695980.pdf; ComponentLink2URL: http://www.farnell.com/cad/1670054.zip; ComponentLink2Description: http://www.farnell.com/cad/1670054.zip; Supplier 1: Mouser; Supplier Part Number 1: 710-742792023; Supplier 2: Farnell; Supplier Part Number 2: 1635732; Supplier 3: Digi-Key; Supplier Part Number 3: 732-1613-1-ND; Manufacturer Part Number: 742792023
J1 = 691321100002: WR-TBL Series 3211 - 3.50 mm Vertical PCB Header; Manufacturer: Wurth Electronics; Description: Barrier Strip Terminal Block, 10A, 1 Row(s), 1 Deck(s); Number of Positions Per Level: 2; Number of Levels: 1; Current: 10A; Voltage: 300V; Pitch: 0.138inch; Supplier: Mouser; Supplier Part Number: 710-691321100002; Manufacturer Part Number: 691321100002; RoHS: Yes; Category: Terminal Blocks; Stock: 2512; Pricing: 1=0.44, 10=0.394, 50=0.34, 100=0.305, 1000=0.269, 10000=0.268 (USD); Mounting Technology: Through Hole; Color: Green; Contact Material: Brass; Package Quantity: 1000; Packaging: Bulk; Number of Rows: 1; Termination: Solder; Number of Contacts: 2; Orientation: Vertical; Series: WR-TBL Series 3211; Voltage Rating: 300V; Length: 7mm; Width: 8.1mm; Height: 12.7mm; RoHS Compliant: Yes; Reach SVHC Compliant: Unknown; Lead Free: 5697LeadFree; ComponentLink1URL: https://datasheet.ciiva.com/8043/1442231-8043542.pdf?src-supplier=Element14; ComponentLink1Description: https://datasheet.ciiva.com/8043/1442231-8043542.pdf?src-supplier=Element14; ComponentLink2URL: https://datasheet.ciiva.com/795/6913211000xx-795780.pdf?src-supplier=Digikey; ComponentLink2Description: https://datasheet.ciiva.com/795/6913211000xx-795780.pdf?src-supplier=Digikey; ComponentLink3URL: https://datasheet.ciiva.com/48692/001088697-da-01-en-wr-tbl-terminal-block3211-691321100002-48692842.pdf?src-supplier=Conrad; ComponentLink3Description: https://datasheet.ciiva.com/48692/001088697-da-01-en-wr-tbl-terminal-block3211-691321100002-48692842.pdf?src-supplier=Conrad; Supplier 1: Mouser; Supplier Part Number 1: 710-691321100002; Supplier 2: Farnell; Supplier Part Number 2: 1841308; Supplier 3: Digikey; Supplier Part Number 3: 732-2763-ND
J2 = 691321100006: WR-TBL Series 3211 - 3.50 mm Vertical PCB Header; Manufacturer: Wurth Electronics; Description: Barrier Strip Terminal Block, 10A, 1 Row(s), 1 Deck(s); Current Rating: 10.5A; Number of Positions Per Level: 6; Number of Levels: 1; Current: 10A; Voltage: 300V; Pitch: 0.138inch; Supplier: Mouser; Supplier Part Number: 710-691321100006; Manufacturer Part Number: 691321100006; RoHS: Yes; Category: Terminal Blocks; Stock: 612; Pricing: 1=1.32, 10=1.18, 50=1.02, 100=0.914, 1000=0.805, 10000=0.804 (USD); Mounting Technology: Through Hole; Color: Green; Contact Material: Brass; Number of Rows: 1; Package Quantity: 520; Packaging: Bulk; Termination: Solder; Number of Contacts: 6; Contact Gender: Male; Orientation: Vertical; Series: WR-TBL Series 3211; Length: 7mm; Width: 25.6mm; Height: 12.7mm; RoHS Compliant: Yes; Reach SVHC Compliant: Unknown; ComponentLink1URL: https://datasheet.ciiva.com/8043/1442231-8043549.pdf?src-supplier=Element14; ComponentLink1Description: https://datasheet.ciiva.com/8043/1442231-8043549.pdf?src-supplier=Element14; ComponentLink2URL: https://datasheet.ciiva.com/796/6913211000xx-796060.pdf?src-supplier=Digikey; ComponentLink2Description: https://datasheet.ciiva.com/796/6913211000xx-796060.pdf?src-supplier=Digikey; ComponentLink3URL: https://datasheet.ciiva.com/48692/001088701-da-01-en-wr-tbl-terminal-block3211-691321100006-48692844.pdf?src-supplier=Conrad; ComponentLink3Description: https://datasheet.ciiva.com/48692/001088701-da-01-en-wr-tbl-terminal-block3211-691321100006-48692844.pdf?src-supplier=Conrad; Supplier 1: Mouser; Supplier Part Number 1: 710-691321100006; Supplier 2: Farnell; Supplier Part Number 2: 1841313; Supplier 3: Digikey; Supplier Part Number 3: 732-2767-ND
J3 = 53047-0810: 1.25mm Pitch, PicoBlade PCB Header, Single Row, Vertical, Through Hole, Tin Plating, Friction Lock, 8 Circuits, Tray, 2.30mm PC Tail Length; Manufacturer: Molex; Number of Contacts: 8; Contact Resistance: 20mR; Gender: Male; Current Rating: 1A; Voltage Rating: 125V; Insulation Resistance: 100MR; Glow Wire Compliant: Non-compliant; Supplier 1: Mouser; Supplier Part Number 1: 538-53047-0810; Manufacturer Part Number: 53047-0810; Stock 1: 13800; Pricing 1: 1 = 0.50000, 10 = 0.48300, 50 = 0.48300, 100 = 0.38300, 1000 = 0.29100, 10000 = 0.22600 (USD); RoHS: Yes; Mount: Through Hole; Case/Package: 0810; Contact Plating: Tin; Contact Material: Bronze; Color: Natural; Housing Color: Natural; Housing Material: Polyamide; Min Operating Temperature: -40°C; Max Operating Temperature: 85°C; Termination: Through Hole; Number of Rows: 1; Orientation: Vertical; Packaging: Tray; Number of Positions: 8; Package Quantity: 2000; Voltage Rating (DC): 125V; Number of Circuits: 8; Pitch: 1.25mm; Radiation Hardening: No; REACH SVHC: Unknown; Lead Free: Lead Free; Flammability Rating: UL94 V-0; ComponentLink1URL: https://datasheet.ciiva.com/30110/64290530470810-pcb-headers-30110449.pdf?src-supplier=Onlinecomponents.com; ComponentLink1Description: https://datasheet.ciiva.com/30110/64290530470810-pcb-headers-30110449.pdf?src-supplier=Onlinecomponents.com; ComponentLink2URL: https://datasheet.ciiva.com/5155/0530470810-pcb-headers-170988-5155236.pdf?src-supplier=Mouser; ComponentLink2Description: https://datasheet.ciiva.com/5155/0530470810-pcb-headers-170988-5155236.pdf?src-supplier=Mouser; ComponentLink3URL: https://datasheet.ciiva.com/11747/0900766b8024e2fd-11747012.pdf?src-supplier=RSComponents; ComponentLink3Description: https://datasheet.ciiva.com/11747/0900766b8024e2fd-11747012.pdf?src-supplier=RSComponents; ComponentLink4URL: https://datasheet.ciiva.com/25291/1815828-25291355.pdf?src-supplier=Newark; ComponentLink4Description: https://datasheet.ciiva.com/25291/1815828-25291355.pdf?src-supplier=Newark; ComponentLink5URL: https://datasheet.ciiva.com/34303/1932504-34303339.pdf?src-supplier=Jameco; ComponentLink5Description: https://datasheet.ciiva.com/34303/1932504-34303339.pdf?src-supplier=Jameco; ComponentLink6URL: https://datasheet.ciiva.com/16658/0530470810-pcb-headers-16658422.pdf?src-supplier=Avnet+Europe; ComponentLink6Description: https://datasheet.ciiva.com/16658/0530470810-pcb-headers-16658422.pdf?src-supplier=Avnet+Europe; ComponentLink7URL: https://datasheet.ciiva.com/17025/70266944-17025467.pdf?src-supplier=Allied+Electronics; ComponentLink7Description: https://datasheet.ciiva.com/17025/70266944-17025467.pdf?src-supplier=Allied+Electronics; ComponentLink8URL: https://datasheet.ciiva.com/14156/ge116819-116832-e-14156239.pdf?src-supplier=Distrelec; ComponentLink8Description: https://datasheet.ciiva.com/14156/ge116819-116832-e-14156239.pdf?src-supplier=Distrelec; Supplier 2: Avnet; Supplier Part Number 2: 0530470810; Stock 2: 6079; Pricing 2: 1 = 0.24815, 10 = 0.22867, 25 = 0.21440, 50 = 0.20775, 100 = 0.20181 (USD); Supplier 3: Farnell; Supplier Part Number 3: 1012258; Stock 3: 17670; Supplier 4: Arrow; Supplier Part Number 4: 53047-0810; Stock 4: 10054; Pricing 4: 1 = 0.35700, 10 = 0.34100, 100 = 0.26730, 500 = 0.24440, 2000 = 0.21170, 6000 = 0.19700, 10000 = 0.18630, 1 = 0.58990, 10 = 0.54650, 100 = 0.37790, 500 = 0.32560, 2000 = 0.25820, 6000 = 0.24640, 2000 = 0.30960, 1 = 0.56010, 10 = 0.53030, 100 = 0.39670, 500 = 0.39230 (USD); Supplier 5: Digi-Key; Supplier Part Number 5: WM1737-ND; Stock 5: 16575; Pricing 5: 1 = 0.54000, 10 = 0.50500, 100 = 0.38690, 500 = 0.33644, 2000 = 0.26915, 6000 = 0.24392, 10000 = 0.22710 (USD)
J4 = 53047-0410: as J6 on sheet MCU; RoHS: Yes; Category: Headers and Wire Housings; Stock 4: 7971; Pricing 4: 1=0,27000, 10=0,23400, 100=0,18000, 500=0,15400, 1000=0,13000, 5000=0,11200, 10000=0,10400 (USD); Mount: Through Hole; Housing Material: Nylon; Contact Plating: Tin; Contact Material: Bronze; Color: Natural; Housing Color: White; Min Operating Temperature: -40°C; Max Operating Temperature: 85°C; Termination: Solder; Number of Contacts: 4; Packaging: Tray; Number of Rows: 1; Orientation: Straight; Length: 6.75mm; Pitch: 1.25mm; Contact Mating Length: 0.089inch; Depth: 3.2mm; ComponentLink1URL: https://datasheet.ciiva.com/3934/87920530470410-pcb-headers-3934064.pdf?src-supplier=Arrow; ComponentLink1Description: https://datasheet.ciiva.com/3934/87920530470410-pcb-headers-3934064.pdf?src-supplier=Arrow; Supplier 1: Mouser; Supplier Part Number 1: 538-53047-0410; Supplier 2: Farnell; Supplier Part Number 2: 9733060; Supplier 3: Digi-Key; Supplier Part Number 3: WM1733-ND; Supplier 4: Avnet; Supplier Part Number 4: 0530470410